# Altium schematic sheet SoftStart_Controll_Circuit.SchDoc
size A4; SheetNumber: 3; SheetTotal: 8
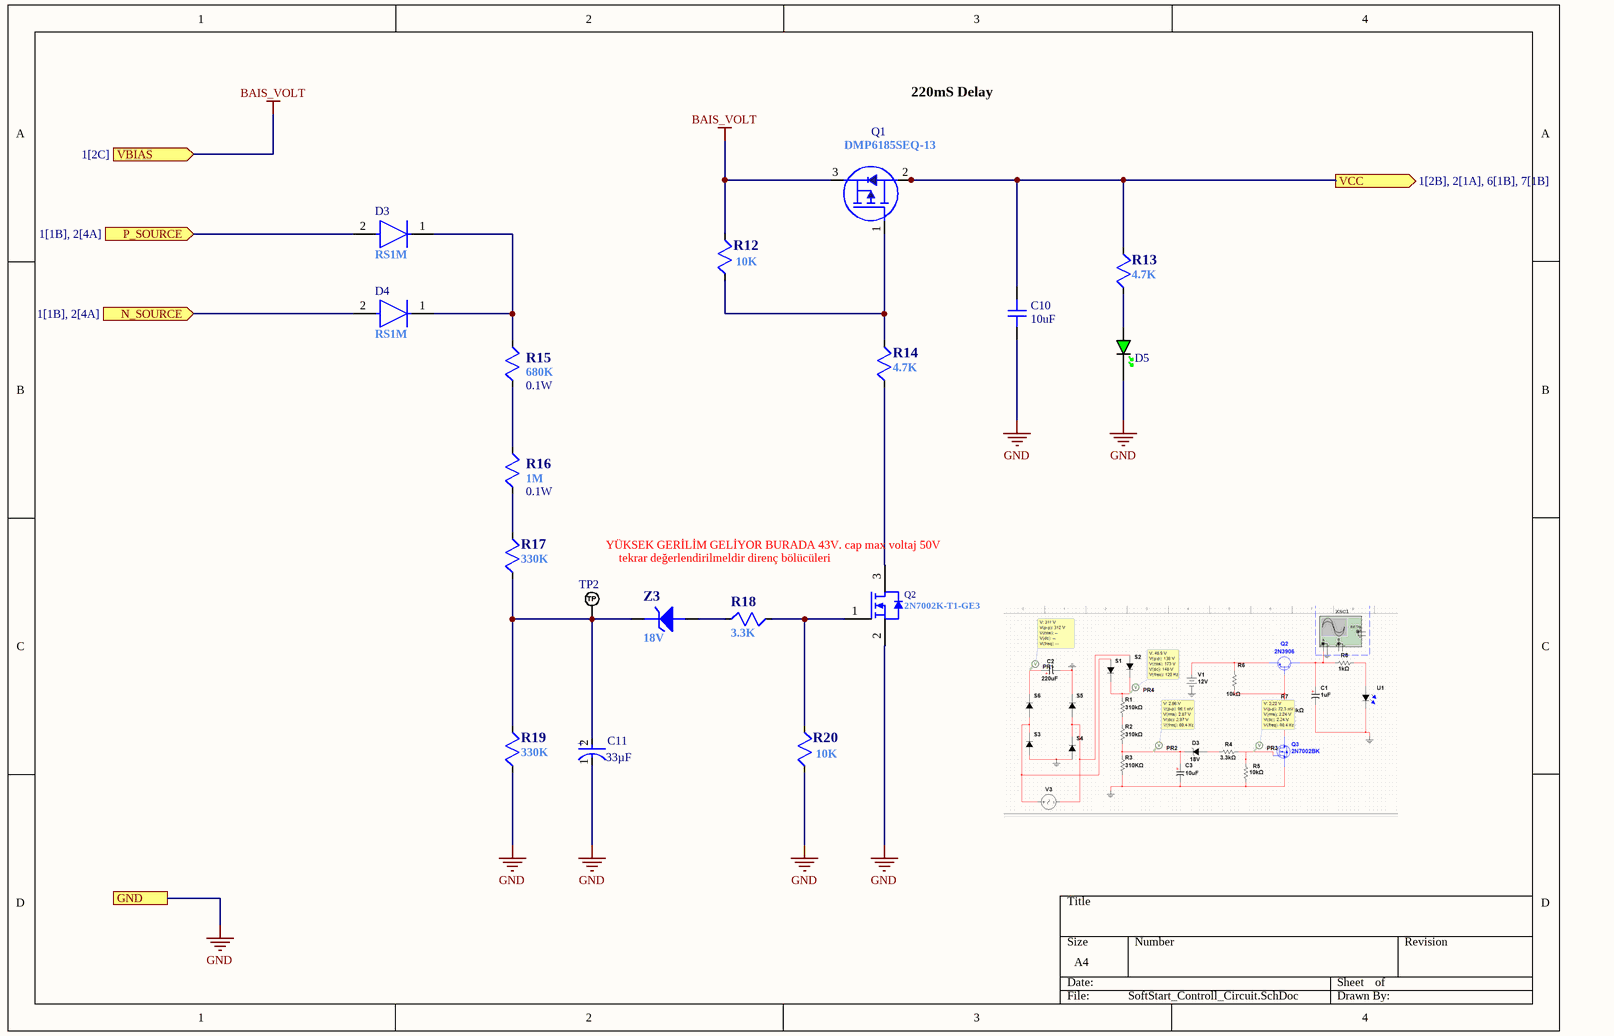
[diagram p0: SoftStart_Controll_Circuit.SchDoc]

## Parts
C10  value 10uF  [CAP_0805]  (hidden comment: CL21A106KAYNNNE)
C11  value 33µF  [FP-FKE-MFG]  (hidden comment: BXJ50VC33MF80TP)
D3  RS1M  [FP-403AE-MFG]
D4  RS1M  [FP-403AE-MFG]
D5  LTST-C190TGKT  [LED_0603_GREEN]  (value not drawn)
Q1  DMP6185SEQ-13  [SOT223]
Q2  2N7002K-T1-GE3  [SOT23-3]
R12  value 10K  [RESC1608N]  (hidden comment: RC0603JR-0710KL)
R13  value 4.7K  [RESC1608N]  (hidden comment: 0603SAF4701T5E)
R14  value 4.7K  [RESC1608N]  (hidden comment: 0603SAF4701T5E)
R15  value 680K  Power Dissipation: 0.1W  [RESC1608N]  (hidden comment: CRT03F7E6803)
R16  value 1M  Power Dissipation: 0.1W  [RESC1608N]  (hidden comment: RI0603L105JT)
R17  value 330K  [RESC1608N]  (hidden comment: RC0603JR-07330KL)
R18  value 3.3K  [RESC1608N]  (hidden comment: CQ03SAF3301T5E)
R19  value 330K  [RESC1608N]  (hidden comment: RC0603JR-07330KL)
R20  value 10K  [RESC1608N]  (hidden comment: RC0603JR-0710KL)
TP2  TP_NOBOM  [PAD_RND_1MM]  (value not drawn)  (no BOM)
Z3  value 18V  [SOD523C]  (hidden comment: MMSZ18V-HT)

## Ports
GND (see 1[2B], 2[1D], 4[4C], 5[1D], 6[1C], 7[1C], 8[1C]), N_SOURCE (in, see 1[1B], 2[4A]), P_SOURCE (in, see 1[1B], 2[4A]), VBIAS (in, see 1[2C]), VCC (out, see 1[2B], 2[1A], 6[1B], 7[1B])

## Nets
BAIS_VOLT: Q1.3(S) R12.1 ; port VBIAS
GND: C10.2 C11.1(C) D5.K Q2.2 R19.2 R20.2 ; port GND
N_SOURCE: D4.2(A) ; port N_SOURCE
P_SOURCE: D3.2(A) ; port P_SOURCE
VCC: C10.1 Q1.2(D) Q1.4(D) R13.1 ; port VCC
NetC11_2: C11.2(A) R17.1 R19.1 TP2.1(TP) Z3.2(K)
NetD3_1: D3.1(C) D4.1(C) R15.1
NetD5_A: D5.A R13.2
NetQ1_1: Q1.1(G) R12.2 R14.1
NetQ2_1: Q2.1 R18.2 R20.1
NetQ2_3: Q2.3 R14.2
NetR15_2: R15.2 R16.1
NetR16_2: R16.2 R17.2
NetR18_1: R18.1 Z3.1(A)

## Notes on the sheet
- 220mS Delay
- YÜKSEK GERİLİM GELİYOR BURADA 43V. cap max voltaj 50V
- (near Q2) tekrar değerlendirilmeldir direnç bölücüleri
- (in symbol CMP-00287-05444366-1) +

## Library data of the parts
C10 = CAP_0805: MLCC (2012) 0805 10uF 25VDC ±10% X5R
C11 = CMP-00287-05444366-1: Aluminum Electrolytic Capacitor, 33 uF, 50 V, ± 20%, 2000 hours @ 105°C, Radial Can - SMD; Dielectric Material: Aluminium; Voltage: 50V; Ripple Current (AC): 195mA; Lead Diameter: 650µm; Impedance: 680mΩ; Leakage Current: 16.5µA; Max Operating Temperature: 105°C; Contact Plating: Tin; Packaging: Cut Tape; Width: 8.3mm; Schedule B: 8532220020, 8532220020; Number of Pins: 2; RoHS: Compliant; Mount: PCB, Surface Mount; Diameter: 8mm; Material: Aluminium; Lead Free: Lead Free; Height - Seated (Max): 6.1976mm; Termination: SMD/SMT; ESR (Equivalent Series Resistance): 680mΩ; Voltage Rating (AC): 50V; Lifecycle Status: Production; Height: 6.2mm; Voltage Rating: 50V; Life (Hours): 2000hours; Lead Pitch: 2.2mm; NexarPartId: 5444366; Ripple Current: 195mA; REACH SVHC: No SVHC; Voltage Rating (DC): 50V; Length: 6.2mm; Tolerance: 20%; Min Operating Temperature: -55°C; Case/Package: Radial; Radiation Hardening: No
D3 D4 = CMP-07163-000022-1: DIODE GEN PURP 1KV 1A SMA; Manufacturer: ON Semiconductor; Max Surge Forward Current: 30A; Max Repetitive Reverse Voltage: 1000V; Value: 10pF; Max Junction Temp: +150°C; Peak Reverse Current: 5uA; Standoff Height: 0.05mm; ComponentLink2URL: https://www.onsemi.com/pub/Collateral/RS1M-D.PDF; Footprint Url: https://www.onsemi.com/pub/Collateral/403AE.PDF; Mouser Description: On a Reel of 7500, ON Semi 1000V 1A, Diode, 2-Pin DO-214AC RS1M; Package: 403AE; Manufacturer Part Number: RS1M; Temperature Range Low: -55°C; Device Class L1: Discrete Semiconductors; Automotive: No; Height: 2.5mm; Octopart: https://octopart.com/rs1m-on+semiconductor-84331238; Digikey Description: DIODE GEN PURP 1KV 1A SMA; Temperature Range High: +150°C; Capacitance: 10pF; RoHS: TRUE; Device Class L2: Diodes; ComponentLink2Description: Datasheet; Temperature: -55°C to +150°C; Device Class L3: Rectifier Diodes; Forward Current: 1A; Lead Free: Yes; Category: Diode
D5 = LED_0603_GREEN: LED SMD 0603 GREEN 71-450mcd 130° WATER CLEAR
Q1 = MOSFET_P_CHANNEL: P-Channel 60 V 3A (Ta) 2.2W (Ta) Surface Mount SOT-223-3
Q2 = 2N7002: N-Channel 60 V 300mA (Ta) 350mW (Ta) Surface Mount SOT-23-3 (TO-236)
R12 R20 = RES: RES.(1608) 0603 10K Ohms 5% 1/10W 100PPM SMT
R13 R14 = RES: RES.(1608) 0603 4.7K Ohms 1% 1/10W-S 100PPM
R15 = RES: RES.(1608) 0603 680K Ohms 1% 1/10W 100PPM,
R16 = RES: RES.(1608) 0603 1M Ohms 5% 1/10W 200PPM,
R17 R19 = RES: RES.(1608) 0603 330K Ohms 5% 1/10W-S 100PPM
R18 = RES: RES.(1608) 0603 3.3K Ohms 1% 1/10W AUTOMOTIV
TP2 = TEST_POINT_RND_1MM: Test Point Round 1mm (NO BOM)
Z3 = ZENER-1: DIODE ZENER 500mW 18V ±5% SOD123 SMT